# Altium project STM32_OTQ100_TEST_ADAPTER_V2.PrjPcb
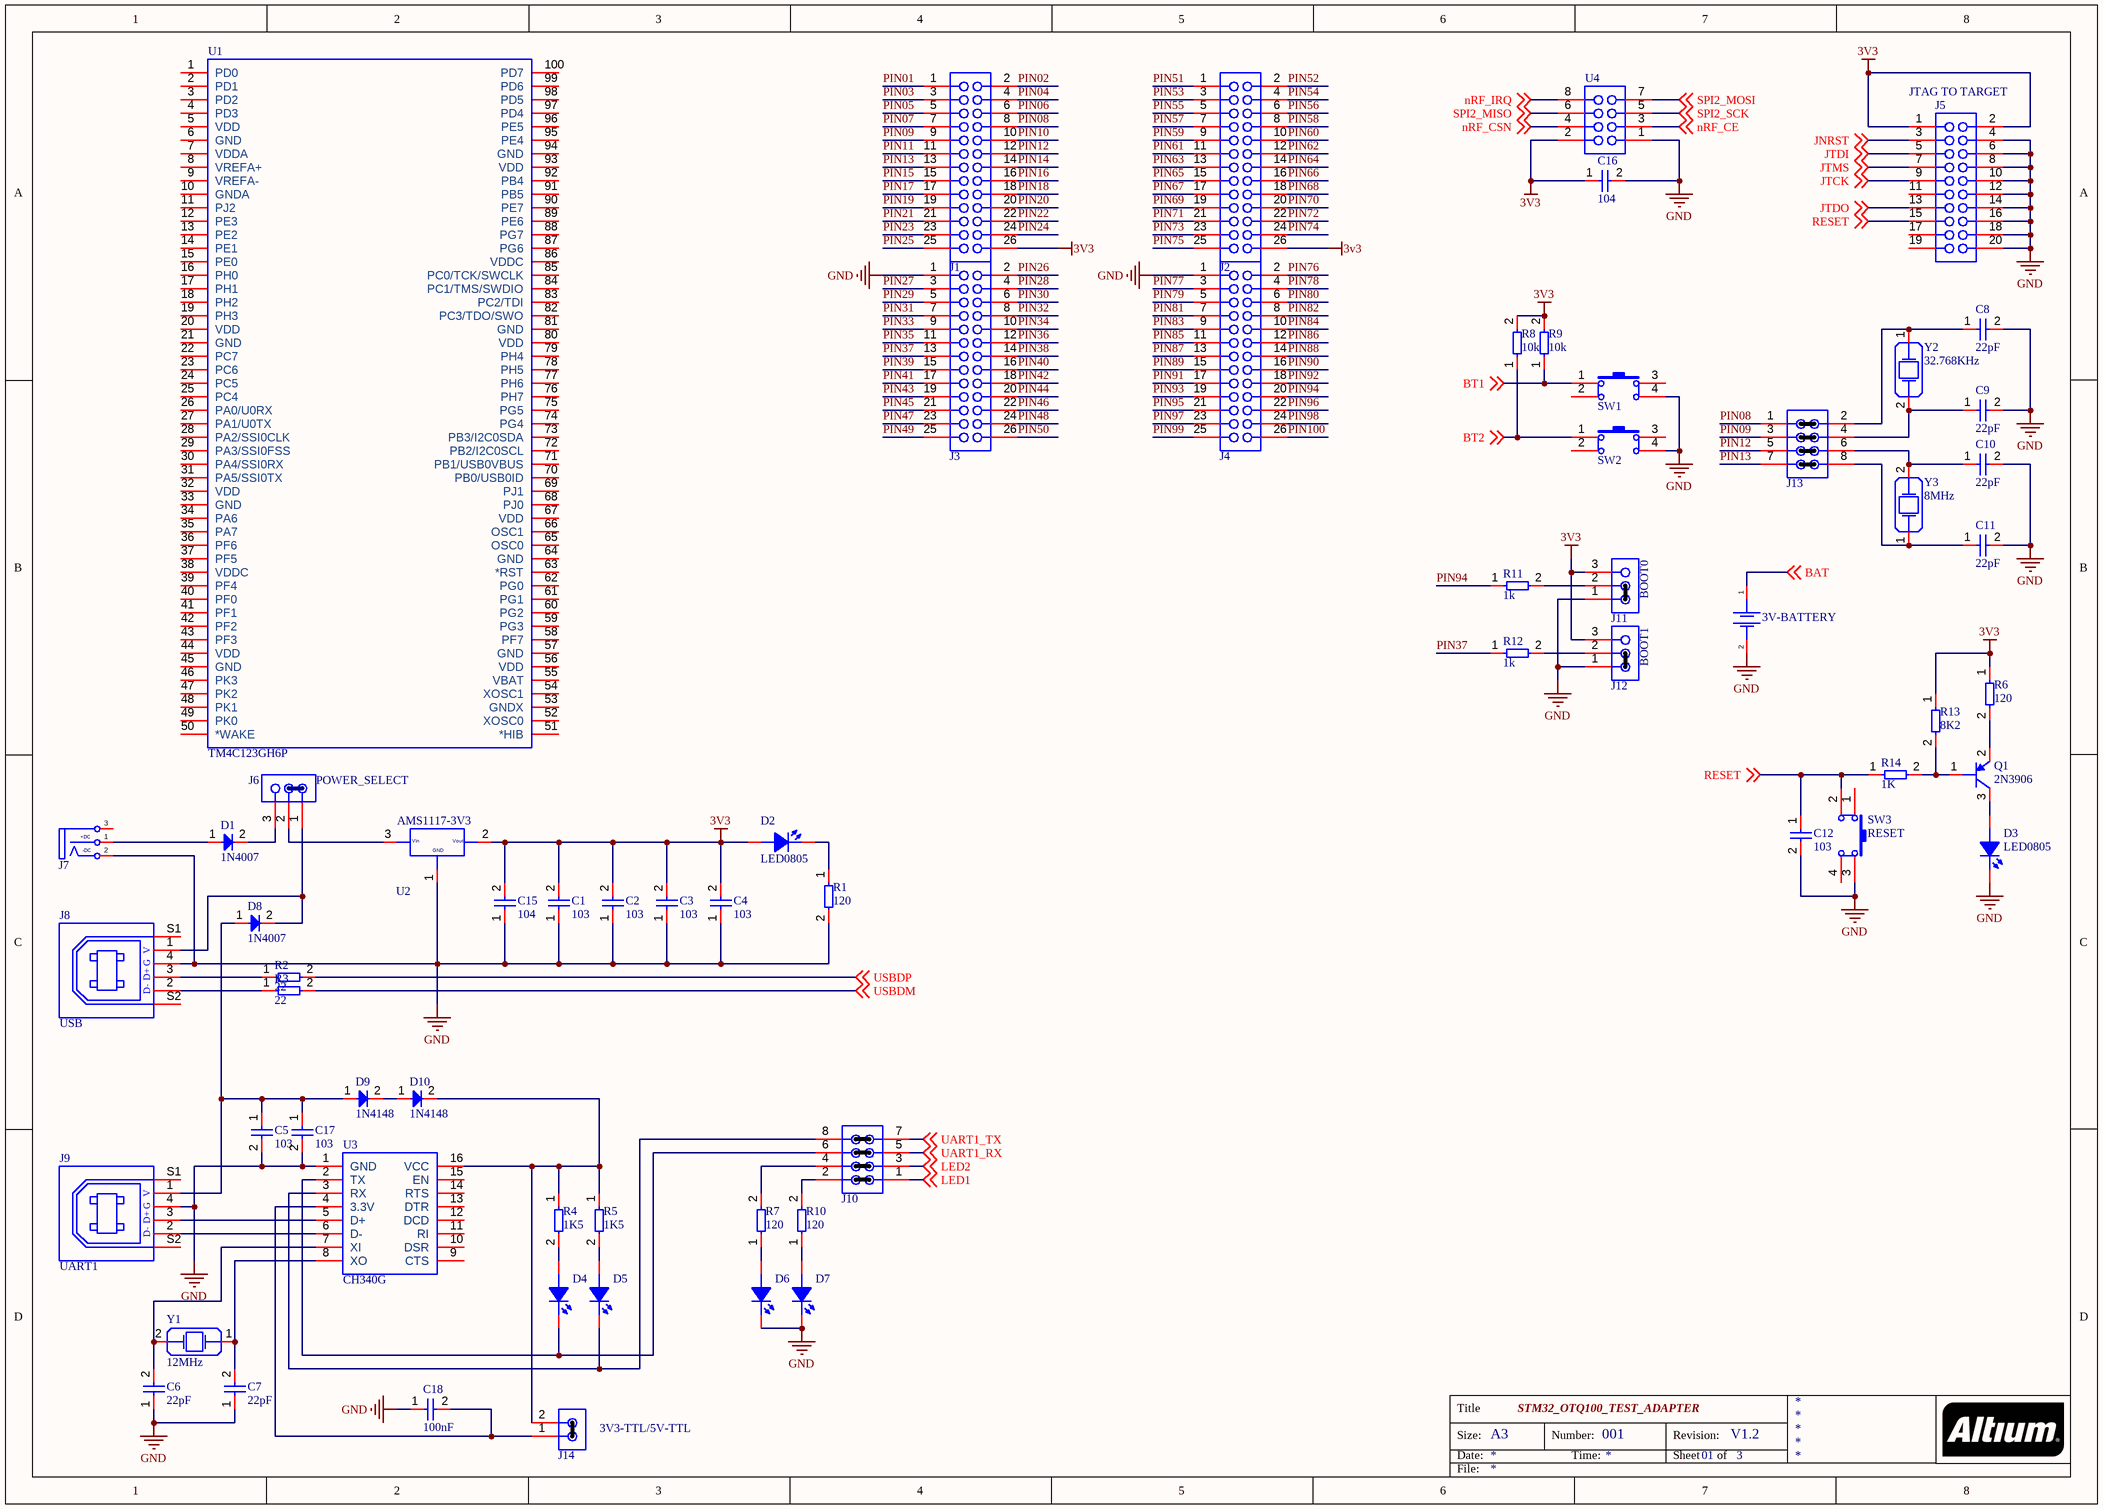
[diagram p0: Sheet2.SchDoc]
1 sheet, 66 parts. Net scope: global (net labels, ports and power ports of the same name join across sheets).
Board file: PCB1.PcbDoc

## Sheet Sheet2.SchDoc
size A3

### Parts
B1  3V-BATTERY  [CR1220]
C1  103  [C0805]
C2  103  [C0805]
C3  103  [C0805]
C4  103  [C0805]
C5  103  [C0805]
C6  22pF  [C0805]
C7  22pF  [C0805]
C8  22pF  [C0805]
C9  22pF  [C0805]
C10  22pF  [C0805]
C11  22pF  [C0805]
C12  103  [C0805]
C15  104  [C1206]
C16  104  [C1206]
C17  103  [C0805]
C18  100nF  [C0805]
D1  1N4007  [DO-214AC(SMA)]
D2  LED0805  [L0805RED]
D3  LED0805  [L0805RED]
D4  LED0805  [L0805RED]  (value not drawn)
D5  LED0805  [L0805RED]  (value not drawn)
D6  LED0805  [L0805RED]  (value not drawn)
D7  LED0805  [L0805RED]  (value not drawn)
D8  1N4007  [DO-214AC(SMA)]
D9  1N4148  [SOD-80]
D10  1N4148  [SOD-80]
J1  Header 13x2 TH Pitch 2.54mm  [Header 13x2 TH Pitch 2.54mm]  (value not drawn)
J2  Header 13x2 TH Pitch 2.54mm  [Header 13x2 TH Pitch 2.54mm]  (value not drawn)
J3  Header 13x2 TH Pitch 2.54mm  [Header 13x2 TH Pitch 2.54mm]  (value not drawn)
J4  Header 13x2 TH Pitch 2.54mm  [Header 13x2 TH Pitch 2.54mm]  (value not drawn)
J5  JTAG TO TARGET  [IDC_CONNECTOR_20_2.54]
J6  POWER_SELECT  [Header 3x1 TH Pitch 2.54mm]
J7  5V-DC  [DC_JACK_161-0721]  (value not drawn)
J8  USB  [USB-B-TYPE]
J9  UART1  [USB-B-TYPE]
J10  PIN_HEADER_4X2_PITCH_2MM_HEIGTH_5MM  [PIN_HEADER_4X2_PITCH_2MM_HEIGTH_5MM]  (value not drawn)
J11  BOOT0  [PIN_HEADER_1X3_PITCH_2MM_HEIGTH_5MM]
J12  BOOT1  [PIN_HEADER_1X3_PITCH_2MM_HEIGTH_5MM]
J13  PIN_HEADER_4X2_PITCH_2MM_HEIGTH_5MM  [PIN_HEADER_4X2_PITCH_2MM_HEIGTH_5MM]  (value not drawn)
J14  3V3-TTL/5V-TTL  [PIN_HEADER_2X1_PITCH_2MM_HEIGTH_5MM]
Q1  2N3906  [SOT23-3]
R1  120  [R0805]
R2  22  [R0805]
R3  22  [R0805]
R4  1K5  [R0805]
R5  1K5  [R0805]
R6  120  [R0805]
R7  120  [R0805]
R8  10k  [R0805]
R9  10k  [R0805]
R10  120  [R0805]
R11  1k  [R0805]
R12  1k  [R0805]
R13  8K2  [R0805]
R14  1K  [R0805]
SW1  Button Hole  [BUTTON_HOLE_5.0mm]  (value not drawn)
SW2  Button Hole  [BUTTON_HOLE_5.0mm]  (value not drawn)
SW3  RESET  [BUTTON_HOLE_5.0mm]
U1  TM4C123GH6P  [PZ100-M]
U2  AMS1117-3V3  [SOT223-3]
U3  CH340G  [SOP16_1.27_3.8]
U4  nRF24L01  [Header 4x2 TH Pitch 2.54mm]  (value not drawn)
Y1  12MHz  [SMD5032]
Y2  32.768KHz  [DT-26]
Y3  8MHz  [SMD5032]

### Nets
3V3: C1.2 C2.2 C3.2 C4.2 C15.2 C16.1 D2.1(A) J1.26 J2.26 J5.1 J5.2 J11.3 J12.3 R6.1 R8.2 R9.2 R13.1 U2.2 U4.2
GND: B1.2 C1.1 C2.1 C3.1 C4.1 C5.2 C6.1 C7.1 C8.2 C9.2 C10.2 C11.2 C12.2 C15.1 C16.2 C17.2 C18.1 D3.2(K) D6.2(K) D7.2(K) J3.1 J4.1 J5.4 J5.6 J5.8 J5.10 J5.12 J5.14 J5.16 J5.18 J5.20 J7.2(DC-) J8.4 J9.4 J11.1 J12.1 R1.2 SW1.4 SW2.4 SW3.3 U2.1 U3.1(GND) U4.1
BAT: B1.1 ; off-sheet BAT
BT1: R9.1 SW1.1 ; off-sheet BT1
BT2: R8.1 SW2.1 ; off-sheet BT2
JNRST: J5.3 ; off-sheet JNRST
JTCK: J5.9 ; off-sheet JTCK
JTDI: J5.5 ; off-sheet JTDI
JTDO: J5.13 ; off-sheet JTDO
JTMS: J5.7 ; off-sheet JTMS
LED1: J10.1 ; off-sheet LED1
LED2: J10.3 ; off-sheet LED2
nRF_CE: U4.3 ; off-sheet nRF_CE
nRF_CSN: U4.4 ; off-sheet nRF_CSN
nRF_IRQ: U4.8 ; off-sheet nRF_IRQ
PIN01: J1.1
PIN02: J1.2
PIN03: J1.3
PIN04: J1.4
PIN05: J1.5
PIN06: J1.6
PIN07: J1.7
PIN08: J1.8 J13.1
PIN09: J1.9 J13.3
PIN10: J1.10
PIN11: J1.11
PIN12: J1.12 J13.5
PIN13: J1.13 J13.7
PIN14: J1.14
PIN15: J1.15
PIN16: J1.16
PIN17: J1.17
PIN18: J1.18
PIN19: J1.19
PIN20: J1.20
PIN21: J1.21
PIN22: J1.22
PIN23: J1.23
PIN24: J1.24
PIN25: J1.25
PIN26: J3.2
PIN27: J3.3
PIN28: J3.4
PIN29: J3.5
PIN30: J3.6
PIN31: J3.7
PIN32: J3.8
PIN33: J3.9
PIN34: J3.10
PIN35: J3.11
PIN36: J3.12
PIN37: J3.13 R12.1
PIN38: J3.14
PIN39: J3.15
PIN40: J3.16
PIN41: J3.17
PIN42: J3.18
PIN43: J3.19
PIN44: J3.20
PIN45: J3.21
PIN46: J3.22
PIN47: J3.23
PIN48: J3.24
PIN49: J3.25
PIN50: J3.26
PIN51: J2.1
PIN52: J2.2
PIN53: J2.3
PIN54: J2.4
PIN55: J2.5
PIN56: J2.6
PIN57: J2.7
PIN58: J2.8
PIN59: J2.9
PIN60: J2.10
PIN61: J2.11
PIN62: J2.12
PIN63: J2.13
PIN64: J2.14
PIN65: J2.15
PIN66: J2.16
PIN67: J2.17
PIN68: J2.18
PIN69: J2.19
PIN70: J2.20
PIN71: J2.21
PIN72: J2.22
PIN73: J2.23
PIN74: J2.24
PIN75: J2.25
PIN76: J4.2
PIN77: J4.3
PIN78: J4.4
PIN79: J4.5
PIN80: J4.6
PIN81: J4.7
PIN82: J4.8
PIN83: J4.9
PIN84: J4.10
PIN85: J4.11
PIN86: J4.12
PIN87: J4.13
PIN88: J4.14
PIN89: J4.15
PIN90: J4.16
PIN91: J4.17
PIN92: J4.18
PIN93: J4.19
PIN94: J4.20 R11.1
PIN95: J4.21
PIN96: J4.22
PIN97: J4.23
PIN98: J4.24
PIN99: J4.25
PIN100: J4.26
RESET: C12.1 J5.15 R14.1 SW3.2 ; off-sheet RESET
SPI2_MISO: U4.6 ; off-sheet SPI2_MISO
SPI2_MOSI: U4.7 ; off-sheet SPI2_MOSI
SPI2_SCK: U4.5 ; off-sheet SPI2_SCK
UART1_RX: J10.5 ; off-sheet UART1_RX
UART1_TX: J10.7 ; off-sheet UART1_TX
USBDM: R3.2 ; off-sheet USBDM
USBDP: R2.2 ; off-sheet USBDP
NetC5_1: C5.1 C17.1 D8.1 D9.1 J9.1
NetC6_2: C6.2 U3.7(XI) Y1.2
NetC7_2: C7.2 U3.8(XO) Y1.1
NetC8_1: C8.1 J13.2 Y2.1
NetC9_1: C9.1 J13.4 Y2.2
NetC10_1: C10.1 J13.6 Y3.2
NetC11_1: C11.1 J13.8 Y3.1
NetC18_2: C18.2 J14.1 U3.4(3.3V)
NetD1_1: D1.1 J7.1(DS+)
NetD1_2: D1.2 J6.3
NetD2_2: D2.2(K) R1.1
NetD3_1: D3.1(A) Q1.3(C)
NetD4_1: D4.1(A) R4.2
NetD4_2: D4.2(K) J10.6 U3.2(TX)
NetD5_1: D5.1(A) R5.2
NetD5_2: D5.2(K) J10.8 U3.3(RX)
NetD6_1: D6.1(A) R7.1
NetD7_1: D7.1(A) R10.1
NetD8_2: D8.2 J6.1 J8.1
NetD9_2: D9.2 D10.1
NetD10_2: D10.2 J14.2 R4.1 R5.1 U3.16(VCC)
NetJ6_2: J6.2 U2.3
NetJ8_2: J8.2 R3.1
NetJ8_3: J8.3 R2.1
NetJ9_2: J9.2 U3.6(D-)
NetJ9_3: J9.3 U3.5(D+)
NetJ10_2: J10.2 R10.2
NetJ10_4: J10.4 R7.2
NetJ11_2: J11.2 R11.2
NetJ12_2: J12.2 R12.2
NetQ1_1: Q1.1(B) R13.2 R14.2
NetQ1_2: Q1.2(E) R6.2

Not connected (* = marked no-connect by the designer): J5 11 17 19; J7 3(T); J8 S1 S2; J9 S1 S2; SW1 2 3; SW2 2 3; SW3 1 4; U1 1(PD0) 2(PD1) 3(PD2) 4(PD3) 5(VDD) 6(GND) 7(VDDA) 8(VREFA+) 9(VREFA-) 10(GNDA) 11(PJ2) 12(PE3) 13(PE2) 14(PE1) 15(PE0) 16(PH0) 17(PH1) 18(PH2) 19(PH3) 20(VDD) 21(GND) 22(PC7) 23(PC6) 24(PC5) 25(PC4) 26(PA0/U0RX) 27(PA1/U0TX) 28(PA2/SSI0CLK) 29(PA3/SSI0FSS) 30(PA4/SSI0RX) 31(PA5/SSI0TX) 32(VDD) 33(GND) 34(PA6) 35(PA7) 36(PF6) 37(PF5) 38(VDDC) 39(PF4) 40(PF0) 41(PF1) 42(PF2) 43(PF3) 44(VDD) 45(GND) 46(PK3) 47(PK2) 48(PK1) 49(PK0) 50(*WAKE) 51(*HIB) 52(XOSC0) 53(GNDX) 54(XOSC1) 55(VBAT) 56(VDD) 57(GND) 58(PF7) 59(PG3) 60(PG2) 61(PG1) 62(PG0) 63(*RST) 64(GND) 65(OSC0) 66(OSC1) 67(VDD) 68(PJ0) 69(PJ1) 70(PB0/USB0ID) 71(PB1/USB0VBUS) 72(PB2/I2C0SCL) 73(PB3/I2C0SDA) 74(PG4) 75(PG5) 76(PH7) 77(PH6) 78(PH5) 79(PH4) 80(VDD) 81(GND) 82(PC3/TDO/SWO) 83(PC2/TDI) 84(PC1/TMS/SWDIO) 85(PC0/TCK/SWCLK) 86(VDDC) 87(PG6) 88(PG7) 89(PE6) 90(PE7) 91(PB5) 92(PB4) 93(VDD) 94(GND) 95(PE4) 96(PE5) 97(PD4) 98(PD5) 99(PD6) 100(PD7); U3 9(CTS) 10(DSR) 11(RI) 12(DCD) 13(DTR) 14(RTS) 15(EN)

### Notes on the sheet
- Title
- Size:
- Date:
- A3
- STM32_OTQ100_TEST_ADAPTER
- Number:
- Time:
- 001
- Revision:
- Sheet
- 01
- of
- V1.2
- 3
- File:
- (in symbol AMS1117(SOT-223)) Vin; Vout; GND
- (in symbol JackDC) +DC; -DC
- (in symbol USB B Type) V; G; D+; D-

### Library data of the parts
B1 = Batery
C1-C12 C17 = C0805
C15 C16 = C1206
C18 = Capacitors(SMD)
D1 D8 = Diode 1N4007-DO214AC(SMA)
D9 D10 = 1N4148 (SOD-80)
J5 = IDC_2.54_10x2
J6 = Header 3x1 TH Pitch 2.54mm
J7 = JackDC
J8 J9 = USB B Type
J11 J12 = PIN_HEADER_1X3_PITCH_2MM_HEIGTH_5MM
J14 = PIN_HEADER_2X1_PITCH_2MM_HEIGTH_5MM
R1-R5 R7 R10 = R0805
R6 R8 R9 R11-R14 = Resistor SMD
SW3 = Button Hole
U2 = AMS1117(SOT-223)
U4 = Header 4x2 TH Pitch 2.54mm
Y1 Y3 = Crystal
Y2 = Crystal 32.768KHz